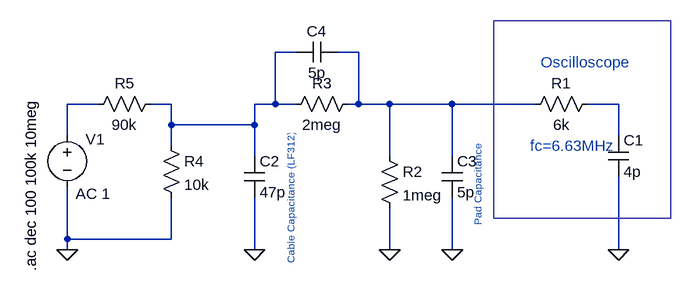
[diagram p0: schematic ADC_passiveInput.asc]
ADC_passiveInput.asc, the LTspice schematic file:
Version 4
SHEET 1 880 680
WIRE -144 0 -176 0
WIRE -48 0 -80 0
WIRE -448 80 -496 80
WIRE -336 80 -368 80
WIRE -176 80 -176 0
WIRE -176 80 -208 80
WIRE -144 80 -176 80
WIRE -48 80 -48 0
WIRE -48 80 -64 80
WIRE 0 80 -48 80
WIRE 96 80 0 80
WIRE 224 80 96 80
WIRE 352 80 304 80
WIRE -336 112 -336 80
WIRE -208 112 -208 80
WIRE -208 112 -336 112
WIRE -496 128 -496 80
WIRE 352 128 352 80
WIRE -336 144 -336 112
WIRE -208 160 -208 112
WIRE 0 160 0 80
WIRE 96 160 96 80
WIRE -496 288 -496 208
WIRE -336 288 -336 224
WIRE -336 288 -496 288
WIRE -496 304 -496 288
WIRE -208 304 -208 224
WIRE 0 304 0 240
WIRE 96 304 96 224
WIRE 352 304 352 192
FLAG -496 304 0
FLAG 352 304 0
FLAG 96 304 0
FLAG -208 304 0
FLAG 0 304 0
SYMBOL voltage -496 112 R0
WINDOW 0 28 22 Left 2
WINDOW 123 13 106 Left 2
WINDOW 39 0 0 Left 2
SYMATTR InstName V1
SYMATTR Value2 AC 1
SYMATTR Value ""
SYMBOL cap 336 128 R0
SYMATTR InstName C1
SYMATTR Value 4p
SYMBOL res 208 96 R270
WINDOW 0 32 56 VTop 2
WINDOW 3 0 56 VBottom 2
SYMATTR InstName R1
SYMATTR Value 6k
SYMBOL cap -224 160 R0
SYMATTR InstName C2
SYMATTR Value 47p
SYMBOL cap 80 160 R0
SYMATTR InstName C3
SYMATTR Value 5p
SYMBOL res -16 144 R0
SYMATTR InstName R2
SYMATTR Value 1meg
SYMBOL res -352 128 R0
SYMATTR InstName R4
SYMATTR Value 10k
SYMBOL res -160 96 R270
WINDOW 0 32 56 VTop 2
WINDOW 3 0 56 VBottom 2
SYMATTR InstName R3
SYMATTR Value 2meg
SYMBOL cap -144 16 R270
WINDOW 0 32 32 VTop 2
WINDOW 3 0 32 VBottom 2
SYMATTR InstName C4
SYMATTR Value 5p
SYMBOL res -464 96 R270
WINDOW 0 32 56 VTop 2
WINDOW 3 0 56 VBottom 2
SYMATTR InstName R5
SYMATTR Value 90k
TEXT -552 72 VRight 2 !.ac dec 100 100k 10meg
TEXT 232 16 Left 2 ;Oscilloscope
TEXT -152 128 VRight 1 ;Cable Capacitance (LF312)
TEXT 136 144 VRight 1 ;Pad Capacitance
TEXT 216 144 Left 2 ;fc=6.63MHz
RECTANGLE Normal 432 256 160 -48

The netlist it stands for:
* ADC_passiveInput.asc
V1 N003 0 AC 1
C1 N004 0 4p
R1 N002 N004 6k
C2 N001 0 47p
C3 N002 0 5p
R2 N002 0 1meg
R4 N001 0 10k
R3 N001 N002 2meg
C4 N001 N002 5p
R5 N003 N001 90k
.ac dec 100 100k 10meg
* Oscilloscope
* Cable Capacitance (LF312)
* Pad Capacitance
* fc=6.63MHz
.backanno
.end